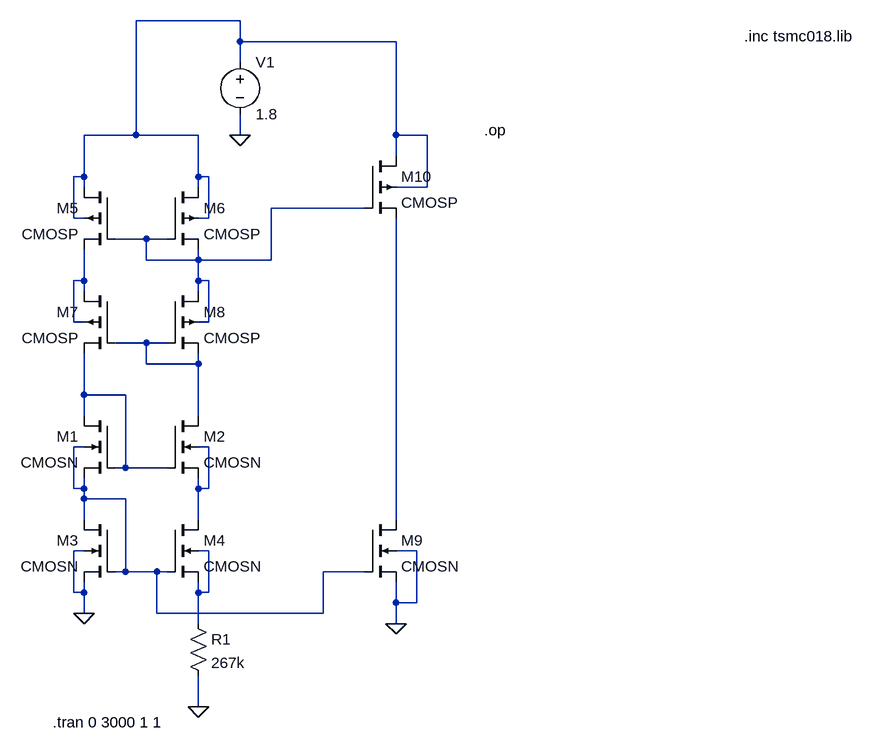
[diagram p0: schematic 200n_Current_Reference.asc]
200n_Current_Reference.asc, the LTspice schematic file:
Version 4
SHEET 1 1356 680
WIRE 400 -432 240 -432
WIRE 400 -400 400 -432
WIRE 640 -400 400 -400
WIRE 400 -368 400 -400
WIRE 240 -256 240 -432
WIRE 240 -256 160 -256
WIRE 336 -256 240 -256
WIRE 400 -256 400 -288
WIRE 640 -256 640 -400
WIRE 688 -256 640 -256
WIRE 640 -224 640 -256
WIRE 160 -192 160 -256
WIRE 160 -192 144 -192
WIRE 336 -192 336 -256
WIRE 352 -192 336 -192
WIRE 160 -176 160 -192
WIRE 336 -176 336 -192
WIRE 688 -176 688 -256
WIRE 688 -176 640 -176
WIRE 592 -144 448 -144
WIRE 144 -128 144 -192
WIRE 160 -128 144 -128
WIRE 352 -128 352 -192
WIRE 352 -128 336 -128
WIRE 256 -96 208 -96
WIRE 288 -96 256 -96
WIRE 256 -64 256 -96
WIRE 336 -64 336 -80
WIRE 336 -64 256 -64
WIRE 448 -64 448 -144
WIRE 448 -64 336 -64
WIRE 160 -32 160 -80
WIRE 160 -32 144 -32
WIRE 336 -32 336 -64
WIRE 352 -32 336 -32
WIRE 160 -16 160 -32
WIRE 336 -16 336 -32
WIRE 144 32 144 -32
WIRE 160 32 144 32
WIRE 352 32 352 -32
WIRE 352 32 336 32
WIRE 256 64 208 64
WIRE 288 64 256 64
WIRE 256 96 256 64
WIRE 336 96 336 80
WIRE 336 96 256 96
WIRE 160 144 160 80
WIRE 224 144 160 144
WIRE 160 176 160 144
WIRE 336 176 336 96
WIRE 160 224 144 224
WIRE 352 224 336 224
WIRE 224 256 224 144
WIRE 224 256 208 256
WIRE 288 256 224 256
WIRE 144 288 144 224
WIRE 160 288 160 272
WIRE 160 288 144 288
WIRE 336 288 336 272
WIRE 352 288 352 224
WIRE 352 288 336 288
WIRE 160 304 160 288
WIRE 224 304 160 304
WIRE 160 336 160 304
WIRE 336 336 336 288
WIRE 640 336 640 -128
WIRE 160 384 144 384
WIRE 352 384 336 384
WIRE 672 384 640 384
WIRE 224 416 224 304
WIRE 224 416 208 416
WIRE 272 416 224 416
WIRE 288 416 272 416
WIRE 592 416 528 416
WIRE 144 448 144 384
WIRE 160 448 160 432
WIRE 160 448 144 448
WIRE 336 448 336 432
WIRE 352 448 352 384
WIRE 352 448 336 448
WIRE 640 464 640 432
WIRE 672 464 672 384
WIRE 672 464 640 464
WIRE 160 480 160 448
WIRE 272 480 272 416
WIRE 528 480 528 416
WIRE 528 480 272 480
WIRE 336 496 336 448
WIRE 640 496 640 464
WIRE 336 624 336 576
FLAG 336 624 0
FLAG 400 -256 0
FLAG 160 480 0
FLAG 640 496 0
SYMBOL cmosn 208 176 M0
SYMATTR InstName M1
SYMATTR Value2 l=180n w=1u
SYMBOL cmosn 288 176 R0
SYMATTR InstName M2
SYMATTR Value2 l=180n w=1u
SYMBOL cmosn 208 336 M0
SYMATTR InstName M3
SYMATTR Value2 l=180n w=1u
SYMBOL cmosn 288 336 R0
SYMATTR InstName M4
SYMATTR Value2 l=180n w=1u m=4
SYMBOL cmosp 208 -176 M0
SYMATTR InstName M5
SYMATTR Value2 l=180n w=1u
SYMBOL cmosp 288 -176 R0
SYMATTR InstName M6
SYMATTR Value2 l=180n w=1u
SYMBOL cmosp 208 -16 M0
SYMATTR InstName M7
SYMATTR Value2 l=180n w=1u
SYMBOL cmosp 288 -16 R0
SYMATTR InstName M8
SYMATTR Value2 l=180n w=1u
SYMBOL res 320 480 R0
SYMATTR InstName R1
SYMATTR Value 267k
SYMBOL voltage 400 -384 R0
WINDOW 123 0 0 Left 0
WINDOW 39 0 0 Left 0
SYMATTR InstName V1
SYMATTR Value 1.8
SYMBOL cmosn 592 336 R0
SYMATTR InstName M9
SYMATTR Value2 l=180n w=1u
SYMBOL cmosp 592 -224 R0
SYMATTR InstName M10
SYMATTR Value2 l=180n w=1u
TEXT 1176 -408 Left 2 !.inc tsmc018.lib
TEXT 112 648 Left 2 !.tran 0 3000 1 1
TEXT 776 -264 Left 2 !.op

The netlist it stands for:
* 200n_Current_Reference.asc
M1 N005 N005 N006 N006 CMOSN l=180n w=1u
M2 N004 N005 N007 N007 CMOSN l=180n w=1u
M3 N006 N006 0 0 CMOSN l=180n w=1u
M4 N007 N006 N009 N009 CMOSN l=180n w=1u m=4
M5 N001 N002 N003 N001 CMOSP l=180n w=1u
M6 N001 N002 N002 N001 CMOSP l=180n w=1u
M7 N003 N004 N005 N003 CMOSP l=180n w=1u
M8 N002 N004 N004 N002 CMOSP l=180n w=1u
R1 N009 0 267k
V1 N001 0 1.8
M9 N008 N006 0 0 CMOSN l=180n w=1u
M10 N001 N002 N008 N001 CMOSP l=180n w=1u
.model NMOS NMOS
.model PMOS PMOS
.lib standard.mos
.inc tsmc018.lib
.tran 0 3000 1 1
.op
.backanno
.end